# EasyEDA Pro project ProPrj_bbTalkie.epro

# Schematic Schematic1
Board Name: Board1; Create Date: 2025-03-17; Page Name: P1; Project Name: bbTalkie; Schematic Name: Schematic1; Update Date: 2025-06-26; BladeWidth: 10; Company: 嘉立创EDA; Page Size: A4; RegionStart: 1; ShowBorder: 1; TitleBlock: 0; TitleBlockPosition: 3; Version: V1.0; XRegionCount: 6; YRegionCount: 4
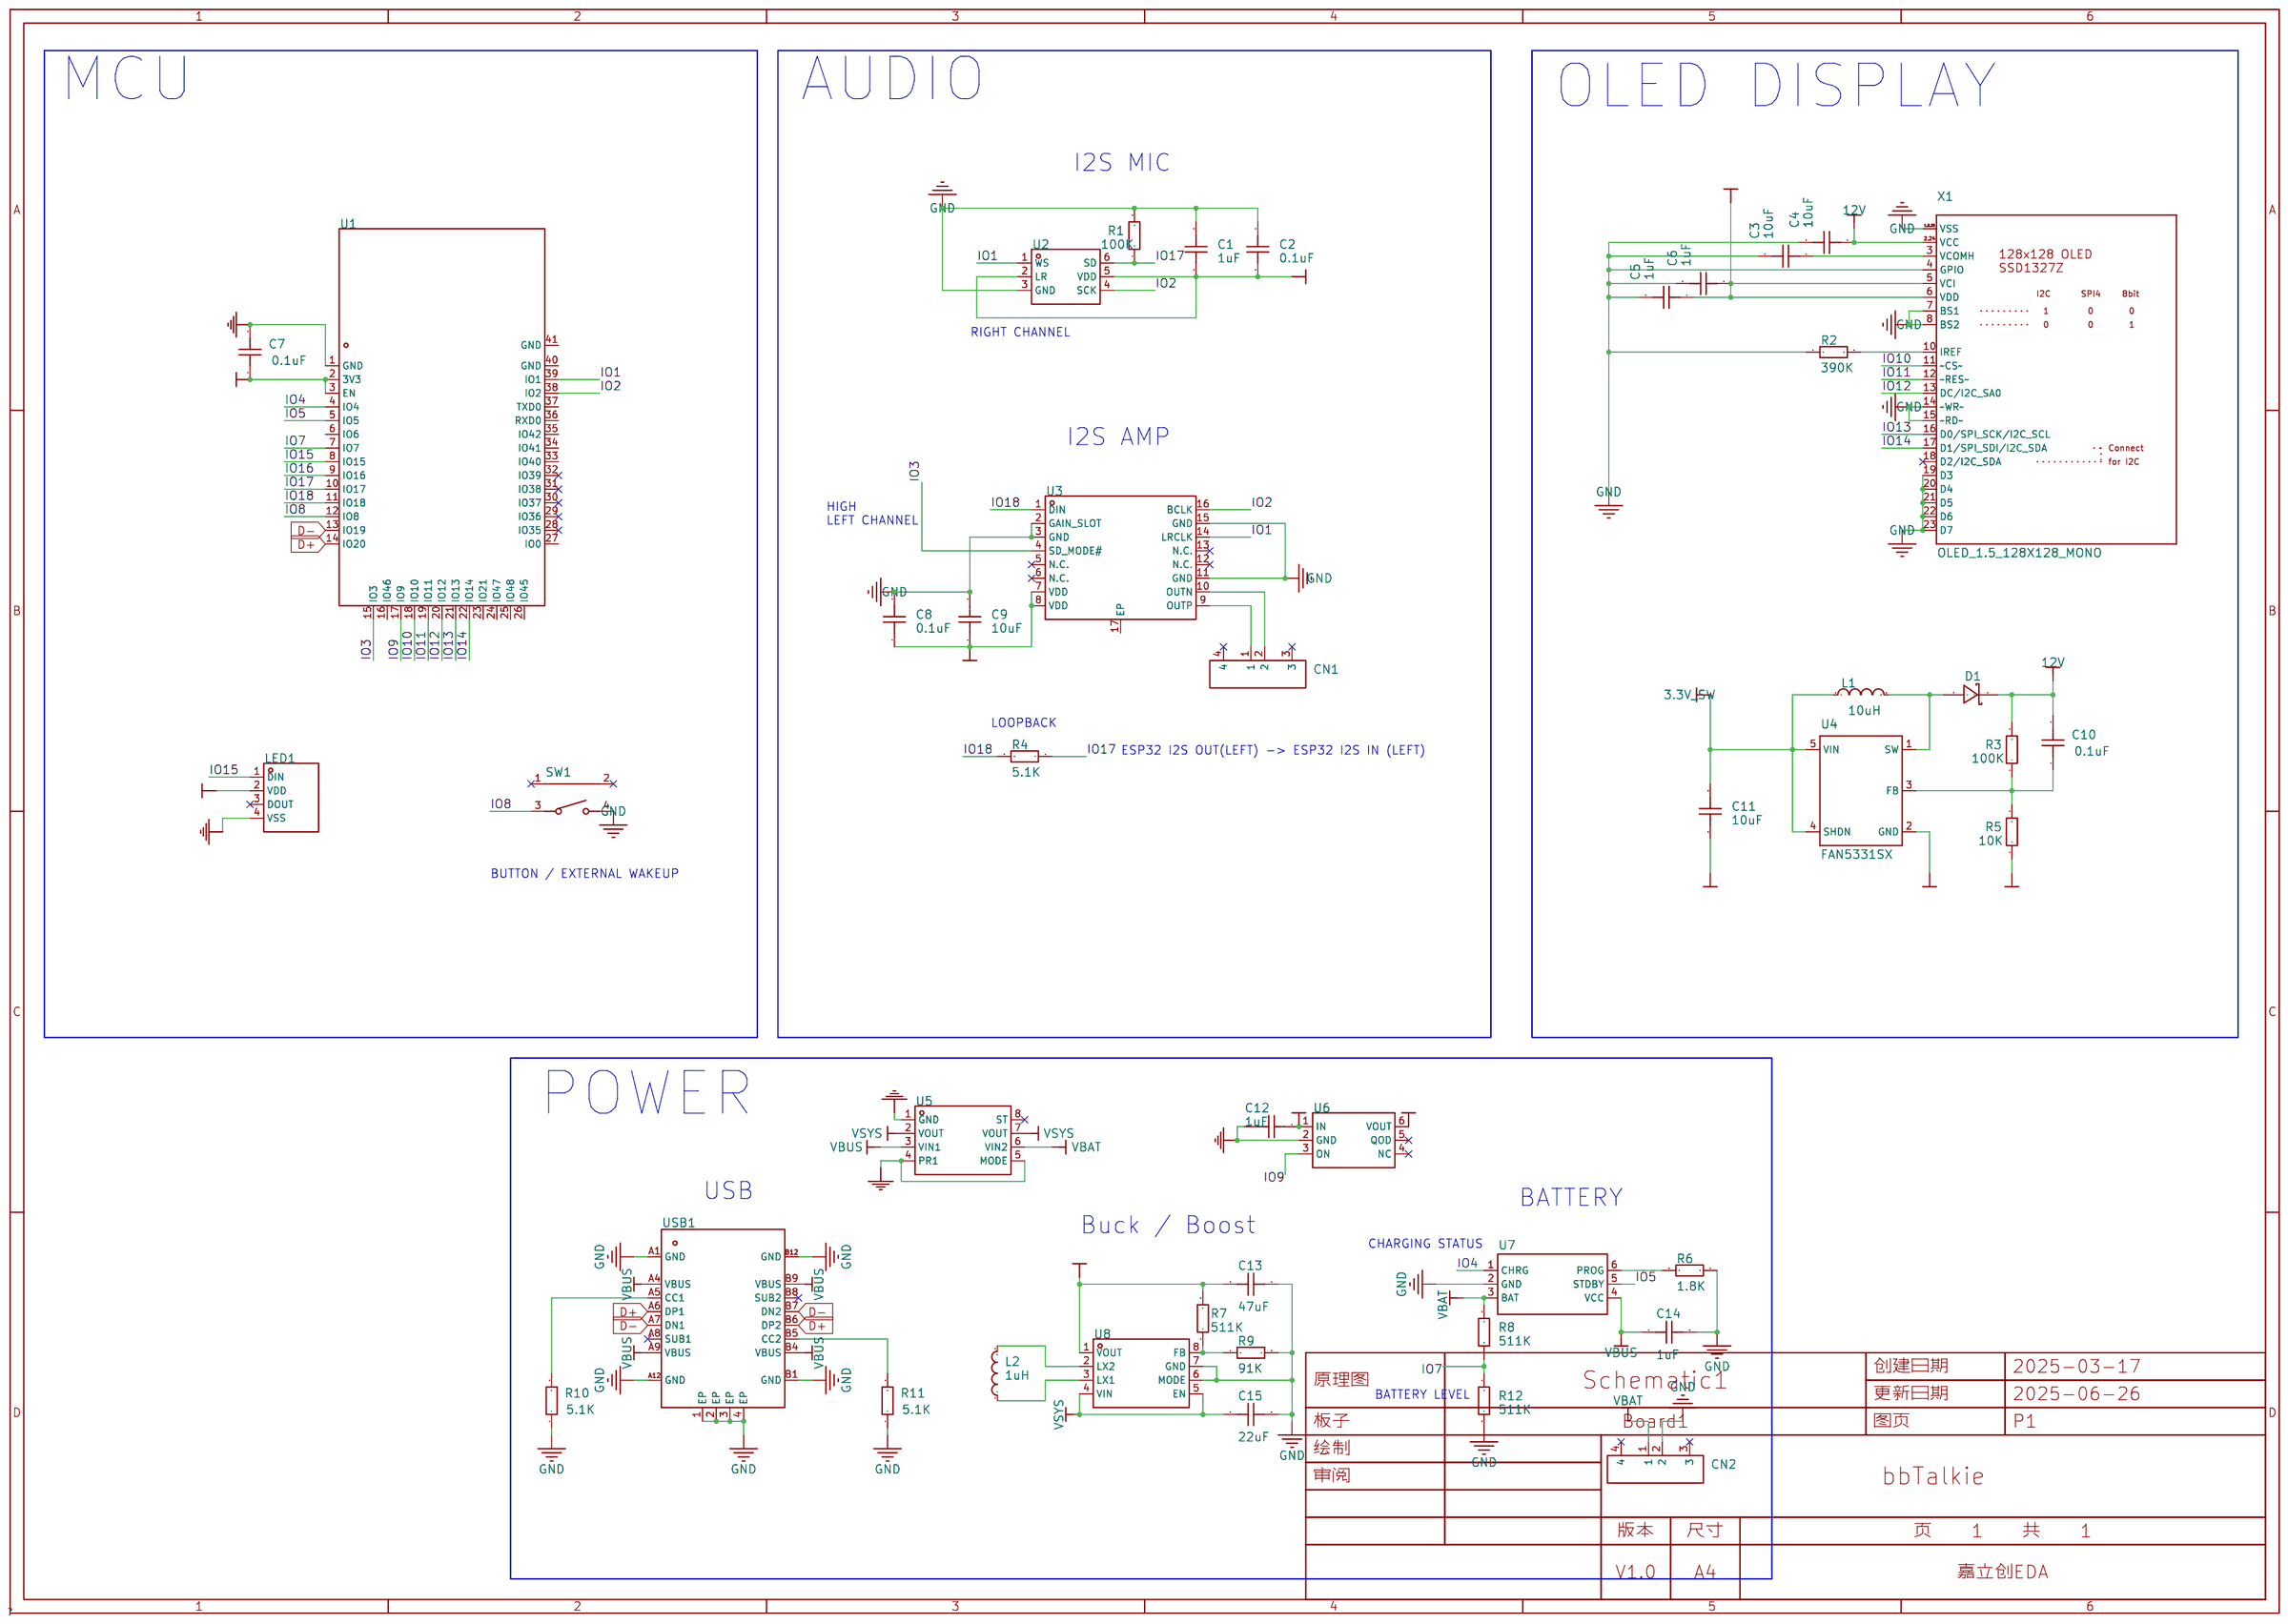
[diagram p0: schematic sheet]

## Parts
C1  1uF  [C0603]
C2  0.1uF  [C0603]
C3  10uF  [C0603]
C4  10uF  [C0603]
C5  1uF  [C0603]
C6  1uF  [C0603]
C7  0.1uF  [C0603]
C8  0.1uF  [C0603]
C9  10uF  [C0603]
C10  0.1uF  [C0603]
C11  10uF  [C0603]
C12  1uF  [C0603]
C13  47uF  [C0603]
C14  1uF  [C0603]
C15  22uF  [C0603]
CN1  SM02B-SRSS-TB(LF)(SN)  [CONN-SMD_2P-P1.00_SM02B-SRSS-TB-LF-SN]
CN2  SM02B-SRSS-TB(LF)(SN)  [CONN-SMD_2P-P1.00_SM02B-SRSS-TB-LF-SN]
D1  B5819WS  [SOD-323_L1.8-W1.3-LS2.5-RD]
L1  10uH  [IND-SMD_L2.5-W2.0_SWPA252012S]
L2  1uH  [IND-SMD_L2.0-W1.6-B]
LED1  WS2812B-4020  [LED-SMD_WS2812B-4020]
R1  100K  [R0603]
R2  390K  [R0603]
R3  100K  [R0603]
R4  5.1K  [R0603]
R5  10K  [R0603]
R6  1.8K  [R0603]
R7  511K  [R0603]
R8  511K  [R0603]
R9  91K  [R0603]
R10  5.1K  [R0603]
R11  5.1K  [R0603]
R12  511K  [R0603]
SW1  TS24CA  [SW-SMD_TS24CA]
U1  ESP32-S3-WROOM-1-N16R8  [WIRELM-SMD_ESP32-S3-WROOM-1]
U2  ICS-43434  [MIC-SMD_6P-L3.5-W2.7-P0.90-BL]
U3  MAX98357AETE+T  [TQFN-16_L3.0-W3.0-P0.50-BL-EP1.5]
U4  FAN5331SX  [SOT23-5@1]
U5  TPS2116DRLR  [SOT-583-8_L2.1-W1.6-P0.50-LS1.6-BL]
U6  TPS22919DCKR  [SC-70-6_L2.2-W1.3-P0.65-LS2.1-BR]
U7  ME4055AM6G-N  [SOT-23-6_L2.9-W1.6-P0.95-LS2.8-BR]
U8  TPS631000DRLR  [SOT-583-8_L2.1-W1.2-P0.50-LS1.6-BL]
USB1  -  [USB-C-SMD_KH-TYPE-C-16P]
X1  OLED_1.5_128X128_MONO  [OLED_1.5IN_128X128MONO]

## Library data of the parts
C1-C15 = CAP_0603: Supplier Footprint: 0603
CN1 CN2 = SM02B-SRSS-TB(LF)(SN): 插针结构:1x2P;间距:1mm;安装方式:卧贴;参考系列:SH;总PIN数:2P;排数:1;每排PIN数:2;行距:-;额定电流:1A;触头材质:铜合金;触头镀层:锡;工作温度范围:-25℃~+85℃;; LCSC Part Name: 1x2P 间距:1mm 卧贴 系列:SH; Supplier Part: C160402; Manufacturer: JST; Supplier Footprint: SMD,P=1mm,卧贴; JLCPCB Part Class: 扩展库; Datasheet: https://atta.szlcsc.com/upload/public/pdf/source/20181010/C265335_7D2AD766CA0E20E745663C87507A223E.pdf; Supplier: LCSC; Pins Structure: 1x2P; Pitch: 1mm; Mounting Style: 卧贴; Reference Series: SH; Number of Pins: 2P; Number of Rows: 1; Number of PINs Per Row: 2; Current Rating (Max): 1A; Contact Material: 铜合金; Contact Plating: 锡; Operating Temperature Range: -25℃~+85℃; Rated Voltage (Max): 50V; Plastic Material: PA; Flame Retardant Rating: UL94V-0; Supplementary Features: 辅助焊脚; Colour: 白色; Z-Height of the Board: 2.9mm; X-Length of Bottom Edge on Board (Spacing Line): 4mm; Y-Width of Bottom Edge on Board: 4.32mm
D1 = B5819WS_C22624: 正向压降(Vf):600mV@1A;直流反向耐压(Vr):40V;平均整流电流(Io):1A;; LCSC Part Name: 电压:40V 电流:1A; Supplier Part: C22624; Manufacturer: CJ(江苏长电/长晶); Supplier Footprint: SOD-323; JLCPCB Part Class: 扩展库; Datasheet: https://atta.szlcsc.com/upload/public/pdf/source/20150407/1457707273359.pdf; Supplier: LCSC; Forward Voltage (Vf@If): 600mV@1A; Reverse Voltage (Vr): 40V; Average Rectified Current (Io): 1A
L1 = SWPA252012S100MT: 电感值:10uH;精度:±20%;额定电流:620mA;饱和电流(Isat):880mA;类型:-;; LCSC Part Name: 10uH ±20% 880mA; Supplier Part: C37428; Manufacturer: Sunlord(顺络); Supplier Footprint: 1008; JLCPCB Part Class: 扩展库; Datasheet: https://atta.szlcsc.com/upload/public/pdf/source/20231024/317626D2AA2F8AB4113C1875E432E6E1.pdf; Supplier: LCSC; Tolerance: ±20%; Rated Current: 620mA; Current - Saturation(Isat): 880mA; DC Resistance(DCR): 690mΩ
L2 = FTC201610S1R0MBCA: 电感值:1uH;精度:±20%;额定电流:4.5A;饱和电流(Isat):4.6A;类型:一体成型电感;; LCSC Part Name: 1uH ±20% 4.6A; Supplier Part: C5832342; Manufacturer: cjiang(长江微电); Supplier Footprint: SMD,1.6x2mm; JLCPCB Part Class: 扩展库; Datasheet: https://atta.szlcsc.com/upload/public/pdf/source/20230602/8FFEDA9C0247A92A0D4B67554BFE4091.pdf; Supplier: LCSC; Tolerance: ±20%; Rated Current: 4.5A; Saturation Current (Isat): 4.6A; DC Resistance (DCR): 35mΩ; Type: 一体成型电感
LED1 = WS2812B-4020: 侧发光，无需外围元器件，适用于鼠标，键盘，机箱风扇，差异化产品（注意防潮，请查阅规格书中对应具体内容）; LCSC Part Name: RGB三色; Supplier Part: C965557; Manufacturer: worldsemi; Supplier Footprint: SMD,2x4mm; JLCPCB Part Class: 扩展库; Datasheet: https://atta.szlcsc.com/upload/public/pdf/source/20201203/C965557_D4D919E14814D6BA44043987D39B5520.pdf; Supplier: LCSC
R1-R12 = Res_0603: Supplier Footprint: 0603
SW1 = TS24CA: 电路结构:单刀单掷;按钮形状:矩形按钮;安装方式:卧贴;开关长度:4.55mm;开关宽度:1.8mm;开关高度:3.5mm;触点电流:50mA;额定电压(DC):12V;带灯:-;机械寿命:-;; LCSC Part Name: 4.55*1.8*3.5mm 卧贴 轻触开关; Supplier Part: C393942; Manufacturer: SHOU HAN(首韩); Supplier Footprint: SMD; JLCPCB Part Class: 扩展库; Datasheet: https://atta.szlcsc.com/upload/public/pdf/source/20190521/C393942_591A9E318887EFA4274D34029981AD99.pdf; Supplier: LCSC; Circuit: 单刀单掷; Actuator Style: 矩形按钮; Mounting Style: 卧贴; Switch Length: 4.55mm; Switch Width: 1.8mm; Switch Height: 3.5mm; Contact Current: 50mA; Voltage Rating (DC): 12V
U1 = ESP32-S3-WROOM-1-N16R8: LCSC Part Name: 通用型Wi-Fi+低功耗蓝牙MCU模组; Supplier Part: C2913202; Manufacturer: ESPRESSIF(乐鑫); Supplier Footprint: SMD,18x25.5mm; JLCPCB Part Class: 扩展库; Datasheet: https://atta.szlcsc.com/upload/public/pdf/source/20220705/4E799F39581577F766659887F738A439.pdf; Supplier: LCSC
U2 = ICS-43434_C5656610: 方向:全指向;信噪比:64dB;灵敏度:-;; Supplier Part: C5656610; Manufacturer: TDK InvenSense(应美盛); JLCPCB Part Class: 扩展库; Datasheet: https://atta.szlcsc.com/upload/public/pdf/source/231023/DS-000069-ICS-43434-v1.2-8194c7772d771e21a553109502704f97.pdf; Supplier: LCSC; Direction: 全指向; Supply Voltage: 1.65V~3.63V; Current Consumption: 550uA; SNR(Signal to Noise Ratio): 64dB
U3 = MAX98357AETE+T: 功放类型:-;扬声器通道数:单声道;输出功率:3.2Wx2@4Ω;; LCSC Part Name: 微型、低成本、PCM 类 D 级放大器具有 AB 级性能; Supplier Part: C910544; Manufacturer: ADI(亚德诺)/MAXIM(美信); Supplier Footprint: TQFN-16-EP(3x3); JLCPCB Part Class: 扩展库; Datasheet: https://atta.szlcsc.com/upload/public/pdf/source/20210106/C910544_CB6DE4B2CEE254A72E6BDB40E718D281.pdf; Supplier: LCSC; Speaker Channels: 单声道; Output Power: 3.2Wx2@4Ω; Supply Voltage: 2.5V~5.5V; Operating Temperature: -40℃~+85℃
U4 = microbuilder_FAN5331_
U5 = TPS2116DRLR: 通道数:2;输入控制逻辑:高电平有效;输出电流:2.5A;工作电压:1.6V~5.5V;导通电阻:42mΩ;; Supplier Part: C3235557; Manufacturer: TI(德州仪器); Supplier Footprint: SOT-583; JLCPCB Part Class: 扩展库; Datasheet: https://www.ti.com/cn/lit/gpn/tps2116; Supplier: LCSC; Number of Channels: 2; Control Input Logic: 高电平有效; Output Current: 2.5A; Voltage - Supply: 1.6V~5.5V; RDS(on): 42mΩ; Operating Temperature	-: -40℃~+105℃
U6 = TPS22919DCKR: 通道数:1;输出电流:1.5A;输入电压:1.6V~5.5V;导通电阻:89mΩ;; Supplier Part: C2149796; Manufacturer: TI(德州仪器); Supplier Footprint: SC-70-6; JLCPCB Part Class: 扩展库; Datasheet: https://www.ti.com/cn/lit/gpn/tps22919; Supplier: LCSC; Number of Outputs: 1; Output Current: 1.5A; Input Voltage: 1.6V~5.5V; Resistor On-State: 89mΩ; Operating Temperature	-: -40℃~+125℃
U7 = ME4055AM6G-N: 600mA锂离子电池充电，双灯; Supplier Part: C82121; Manufacturer: MICRONE(南京微盟); Supplier Footprint: SOT-23-6; JLCPCB Part Class: 扩展库; Datasheet: https://atta.szlcsc.com/upload/public/pdf/source/20220725/CF75E00328DA2B5A5E9B3EE80A9510AE.pdf; Supplier: LCSC
U8 = TPS631000DRLR: 输入电压:1.6V~5.5V;输出电压:1.2V~5.3V;输出电流(最大值):2A;; Supplier Part: C5219190; Manufacturer: TI(德州仪器); Supplier Footprint: SOT-583; JLCPCB Part Class: 扩展库; Datasheet: https://www.ti.com/cn/lit/gpn/tps631000; Supplier: LCSC; Input Voltage: 1.6V~5.5V; Output Voltage: 1.2V~5.3V; Output Current (Max): 2A; Switching Frequency: 2.2MHz; Operating Temperature: -40℃~+125℃; Topology: 降压-升压式; Quiescent Current (Iq): 8uA; Switch tube (built-in/external): 内置
USB1 = KH-TYPE-C-16P: 连接器类型:Type-C;标准:-;公母:母座;触点数量:16;端口数量:1;安装方式:卧贴;额定电流 - 电源:3A;工作温度范围:-40~+85;; LCSC Part Name: Type-C 母座 卧贴; Supplier Part: C709357; Manufacturer: kinghelm(金航标); Supplier Footprint: SMD; JLCPCB Part Class: Extended Part; Datasheet: https://atta.szlcsc.com/upload/public/pdf/source/20200911/C709357_AA8DCEB38BB20E3035A7ED7AE7667837.pdf; Supplier: LCSC; Connector Type: Type-C; Gender: 母座; Number of Contacts: 16; Number of Ports: 1; Mounting Style: 卧贴; Current Rating - Power (Max): 3A; Operating Temperature Range: -40~+85
X1 = adafruit_display_OLED_1.5_128X128_MONO_

## Nets
3.3V: C7.1 C12.2 C13.2 R7.2 U1.2(3V3) U1.3(EN) U6.1(IN) U8.1(VOUT)
3.3V_SW: C1.2 C2.2 C5.1 C6.1 C8.1 C9.1 C11.2 L1.1 LED1.2(VDD) U2.2(LR) U2.5(VDD) U3.7(VDD) U3.8(VDD) U4.4(SHDN) U4.5(VIN) U6.6(VOUT) X1.5(VCI) X1.6(VDD)
12V: C4.1 C10.2 D1.1(K) R3.2 X1.2,24(VCC)
GND: C1.1 C2.1 C3.2 C4.2 C5.2 C6.2 C7.2 C8.2 C9.2 C11.1 C12.1 C13.1 C14.2 C15.2 CN2.2 LED1.4(VSS) R1.2 R2.2 R5.1 R6.1 R9.1 R10.1 R11.1 R12.2 SW1.4 U1.1(GND) U2.3(GND) U3.2(GAIN_SLOT) U3.3(GND) U3.11(GND) U3.15(GND) U4.2(GND) U5.1(GND) U5.4(PR1) U5.5(MODE) U6.2(GND) U7.2(GND) U8.6(MODE) U8.7(GND) USB1.1(EP) USB1.2(EP) USB1.3(EP) USB1.4(EP) USB1.A1(GND) USB1.A12(GND) USB1.B1(GND) USB1.B12(GND) X1.1,9,25(VSS) X1.4(GPIO) X1.7(BS1) X1.8(BS2) X1.14(~WR~) X1.15(~RD~) X1.19(D3) X1.20(D4) X1.21(D5) X1.22(D6) X1.23(D7)
VBAT: CN2.1 R8.1 U5.6(VIN2) U7.3(BAT)
VBUS: C14.1 U5.3(VIN1) U7.4(VCC) USB1.A4(VBUS) USB1.A9(VBUS) USB1.B4(VBUS) USB1.B9(VBUS)
D+: U1.14(IO20) USB1.A6(DP1) USB1.B6(DP2)
D-: U1.13(IO19) USB1.A7(DN1) USB1.B7(DN2)
IO1: U1.39(IO1) U2.1(WS) U3.14(LRCLK)
IO2: U1.38(IO2) U2.4(SCK) U3.16(BCLK)
IO3: U1.15(IO3) U3.4(SD_MODE#)
IO4: U1.4(IO4) U7.1(CHRG)
IO5: U1.5(IO5) U7.5(STDBY)
IO7: R8.2 R12.1 U1.7(IO7)
IO8: SW1.3 U1.12(IO8)
IO9: U1.17(IO9) U6.3(ON)
IO10: U1.18(IO10) X1.11(~CS~)
IO11: U1.19(IO11) X1.12(~RES~)
IO12: U1.20(IO12) X1.13(DC/I2C_SA0)
IO13: U1.21(IO13) X1.16(D0/SPI_SCK/I2C_SCL)
IO14: U1.22(IO14) X1.17(D1/SPI_SDI/I2C_SDA)
IO15: LED1.1(DIN) U1.8(IO15)
IO16: U1.9(IO16)
IO17: R1.1 R4.1 U1.10(IO17) U2.6(SD)
IO18: R4.2 U1.11(IO18) U3.1(DIN)
VSYS: C15.1 U5.2(VOUT) U5.7(VOUT) U8.4(VIN) U8.5(EN)
$1N758: R11.2 USB1.B5(CC2)
$1N759: R10.2 USB1.A5(CC1)
$1N3146: D1.2(A) L1.2 U4.1(SW)
$1N3159: C10.1 R3.1 R5.2 U4.3(FB)
$1N3440: C3.1 X1.3(VCOMH)
$1N3636: R2.1 X1.10(IREF)
$1N11708: CN1.1 U3.9(OUTP)
$1N11713: CN1.2 U3.10(OUTN)
$1N21943: R6.2 U7.6(PROG)
$1N31976: L2.2 U8.2(LX2)
$1N31982: L2.1 U8.3(LX1)
$1N32158: R7.1 R9.2 U8.8(FB)

Not connected (* = marked no-connect by the designer): CN1 3* 4*; CN2 3* 4*; LED1 3(DOUT)*; SW1 1* 2*; U1 6(IO6) 16(IO46) 23(IO21) 24(IO47) 25(IO48) 26(IO45) 27(IO0) 28(IO35)* 29(IO36)* 30(IO37)* 31(IO38)* 32(IO39)* 33(IO40) 34(IO41) 35(IO42) 36(RXD0) 37(TXD0) 40(GND) 41(GND); U3 5(N.C.)* 6(N.C.)* 12(N.C.)* 13(N.C.)* 17(EP); U5 8(ST)*; U6 4(NC)* 5(QOD)*; USB1 A8(SUB1)* B8(SUB2)*; X1 18(D2/I2C_SDA)*

## Notes on the sheet
- MCU
- AUDIO
- OLED DISPLAY
- I2S MIC
- RIGHT CHANNEL
- I2S AMP
- HIGH
  LEFT CHANNEL
- LOOPBACK
- ESP32 I2S OUT(LEFT) -> ESP32 I2S IN (LEFT)
- BUTTON / EXTERNAL WAKEUP
- POWER
- USB
- BATTERY
- Buck / Boost
- CHARGING STATUS
- BATTERY LEVEL

# Board PCB1
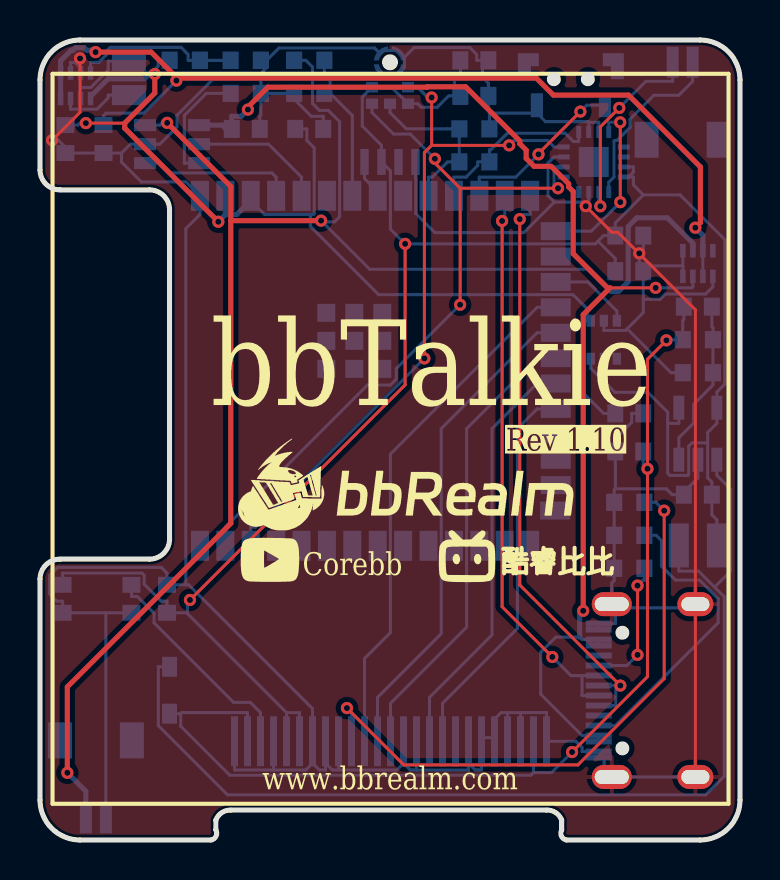
[diagram p1: board, top side]
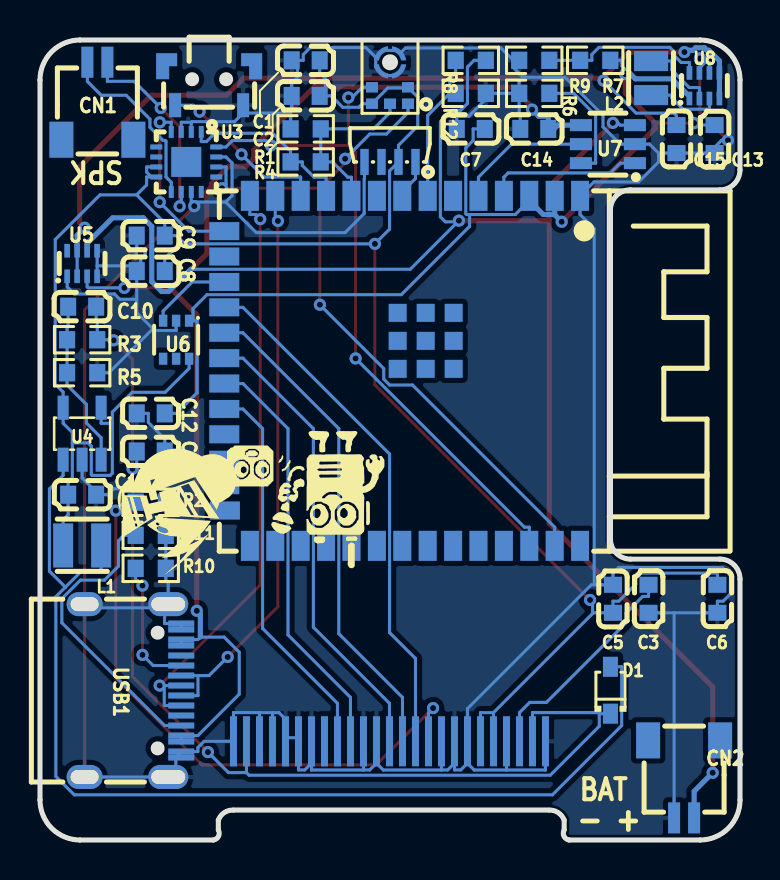
[diagram p2: board, bottom side, seen from below]

Outline 35 x 40 mm; copper layers: Top Layer, Bottom Layer. Coordinates in mm from the lower left corner of the outline.
Outline path: 0,38 0,33.51 arc(0.29,32.8) 1,32.51 5.48,32.51 arc(6.18,32.21) 6.48,31.51 6.48,15.04 arc(6.18,14.34) 5.48,14.04 1,14.04 arc(0.29,13.75) 0,13.04 0,2 arc(0.59,0.59) 2,0 8.55,0 arc(8.8,0.19) 8.79,0.5 8.79,1 arc(9.09,1.37) 9.55,1.5 25.33,1.5 arc(25.79,1.37) 26.08,1 26.08,0.5 arc(26.07,0.19) 26.33,0 33,0 arc(34.41,0.59) 35,2 35,38 arc(34.41,39.41) 33,40 2,40 arc(0.59,39.41) 0,38
Stack: Top Layer 0.035mm / Dielectric1 1.51mm FR4 er 4.5 / Bottom Layer 0.035mm

## Design rules (mm)
spacing copperThickness1oz (default): track to track 0.102, other pairs 0.102 to 0.3
spacing copperThickness2oz: track to track 0.203, other pairs 0.152 to 0.3
spacing Plane_innerPlane: track to track 0.102, other pairs 0.102 to 0.3
spacing Copper_copperRegion: track to track 0.102, other pairs 0.102 to 0.3
track width copperThickness1oz (default): min 0.127, default 0.152, max 2.54
track width copperThickness2oz: min 0.203, default 0.254, max 2.54
differential pair differentialPair (default): width min 0.127, default 0.254, max 2.54; gap min 0.152, default 0.152
pour e741 uses Copper_copperRegion
pour e757 uses Copper_copperRegion

## Placement (name value [footprint] x y rotation side)
C1  1uF  [C0603]  21.72 38.98 180 bottom
C2  0.1uF  [C0603]  21.72 37.21 180 bottom
C3  10uF  [C0603]  4.57 12.06 270 bottom
C4  10uF  [C0603]  29.46 19.43 180 bottom
C5  1uF  [C0603]  6.35 12.06 90 bottom
C6  1uF  [C0603]  1.13 12.06 270 bottom
C7  0.1uF  [C0603]  13.46 35.56 0 bottom
C8  0.1uF  [C0603]  29.46 28.44 0 bottom
C9  10uF  [C0603]  29.46 30.22 0 bottom
C10  0.1uF  [C0603]  32.89 26.67 180 bottom
C11  10uF  [C0603]  32.89 17.27 0 bottom
C12  1uF  [C0603]  29.46 21.33 180 bottom
C13  47uF  [C0603]  1.27 35.05 90 bottom
C14  1uF  [C0603]  10.29 35.56 0 bottom
C15  22uF  [C0603]  3.18 35.05 270 bottom
CN1  SM02B-SRSS-TB(LF)(SN)  [CONN-SMD_2P-P1.00_SM02B-SRSS-TB-LF-SN]  32.13 36.95 180 bottom
CN2  SM02B-SRSS-TB(LF)(SN)  [CONN-SMD_2P-P1.00_SM02B-SRSS-TB-LF-SN]  2.79 3.04 0 bottom
D1  B5819WS  [SOD-323_L1.8-W1.3-LS2.5-RD]  6.48 7.49 90 bottom
L1  10uH  [IND-SMD_L2.5-W2.0_SWPA252012S]  32.89 14.73 180 bottom
L2  1uH  [IND-SMD_L2.0-W1.6-B]  4.44 38.09 90 bottom
LED1  WS2812B-4020  [LED-SMD_WS2812B-4020]  17.5 33.9 180 bottom
R1  100K  [R0603]  21.72 35.56 0 bottom
R2  390K  [R0603]  29.46 16.89 180 bottom
R3  100K  [R0603]  32.89 25.01 180 bottom
R4  5.1K  [R0603]  21.72 33.9 0 bottom
R5  10K  [R0603]  32.89 23.36 0 bottom
R6  1.8K  [R0603]  10.29 37.33 180 bottom
R7  511K  [R0603]  7.24 38.98 180 bottom
R8  511K  [R0603]  13.46 38.98 0 bottom
R9  91K  [R0603]  10.29 38.98 180 bottom
R10  5.1K  [R0603]  29.46 13.58 0 bottom
R11  5.1K  [R0603]  29.46 15.23 0 bottom
R12  511K  [R0603]  13.46 37.33 180 bottom
SW1  TS24CA  [SW-SMD_TS24CA]  26.54 37.71 180 bottom
U1  ESP32-S3-WROOM-1-N16R8  [WIRELM-SMD_ESP32-S3-WROOM-1]  16.89 23.46 270 bottom
U2  ICS-43434  [MIC-SMD_6P-L3.5-W2.7-P0.90-BL]  17.5 38.1 90 bottom
U3  MAX98357AETE+T  [TQFN-16_L3.0-W3.0-P0.50-BL-EP1.5]  27.69 33.9 0 bottom
U4  FAN5331SX  [SOT23-5@1]  32.89 20.31 180 bottom
U5  TPS2116DRLR  [SOT-583-8_L2.1-W1.6-P0.50-LS1.6-BL]  32.89 28.82 180 bottom
U6  TPS22919DCKR  [SC-70-6_L2.2-W1.3-P0.65-LS2.1-BR]  28.19 25.01 90 bottom
U7  ME4055AM6G-N  [SOT-23-6_L2.9-W1.6-P0.95-LS2.8-BR]  6.6 34.79 180 bottom
U8  TPS631000DRLR  [SOT-583-8_L2.1-W1.2-P0.50-LS1.6-BL]  1.78 37.71 180 bottom
USB1  -  [USB-C-SMD_KH-TYPE-C-16P]  30.35 7.47 270 bottom
X1  OLED_1.5_128X128_MONO  [OLED_1.5IN_128X128MONO]  17.53 20.06 0 top

## Footprints (pads in the part's own frame, mm; a bottom-side part is the same pattern mirrored in y, then rotated)
C0603
  rect 0.8x0.9 smd: 1(-0.7,0) 2(0.7,0)
CONN-SMD_2P-P1.00_SM02B-SRSS-TB-LF-SN
  rect 0.6x1.55 smd: 1(-0.5,1.938) 2(0.5,1.938)
  rect 1.2x1.8 smd: 3(1.8,-1.938) 4(-1.8,-1.938)
IND-SMD_L2.0-W1.6-B
  rect 1x1.7 smd: 1(-0.85,0) 2(0.85,0)
IND-SMD_L2.5-W2.0_SWPA252012S
  rect 1x2.2 smd: 1(-0.951,0) 2(0.951,0)
LED-SMD_WS2812B-4020
  rect 0.42x1.3 smd: 1(1.275,0) 2(0.425,0) 3(-0.425,0) 4(-1.275,0)
MIC-SMD_6P-L3.5-W2.7-P0.90-BL
  rect 0.52x0.6 smd: 1(-1.286,-0.9) 2(-0.465,-0.9) 4(-0.465,0.9) 5(-1.286,0.9) 6(-1.286,0)
  custom 0.709x0.71 smd: 3(0.276,-0.452) 3(0.329,0.505) 3(1.234,-0.505) 3(1.286,0.452)
OLED_1.5IN_128X128MONO
  rect 0.35x2.5 smd far side: 1(-7.8,-15.125) 2(-7.15,-15.125) 3(-6.5,-15.125) 4(-5.85,-15.125) 5(-5.2,-15.125) 6(-4.55,-15.125) 7(-3.9,-15.125) 8(-3.25,-15.125) 9(-2.6,-15.125) 10(-1.95,-15.125) 11(-1.3,-15.125) 12(-0.65,-15.125) 13(0,-15.125) 14(0.65,-15.125) 15(1.3,-15.125) 16(1.95,-15.125) 17(2.6,-15.125) 18(3.25,-15.125) 19(3.9,-15.125) 20(4.55,-15.125) 21(5.2,-15.125) 22(5.85,-15.125) 23(6.5,-15.125) 24(7.15,-15.125) 25(7.8,-15.125)
R0603
  rect 0.806x0.864 smd: 1(-0.753,0) 2(0.753,0)
SC-70-6_L2.2-W1.3-P0.65-LS2.1-BR
  rect 0.6x0.42 smd: 1(0.95,-0.65) 2(0.95,0) 3(0.95,0.65) 4(-0.95,0.65) 5(-0.95,0) 6(-0.95,-0.65)
SOD-323_L1.8-W1.3-LS2.5-RD
  rect 1x0.75 smd: 1(-1.173,0) 2(1.173,0)
SOT23-5@1
  rect 0.55x1.2 smd: 1(-0.95,-1.3) 2(0,-1.3) 3(0.95,-1.3) 4(0.95,1.3) 5(-0.95,1.3)
SOT-23-6_L2.9-W1.6-P0.95-LS2.8-BR
  rect 1.1x0.6 smd: 1(1.35,-0.95) 2(1.35,0) 3(1.35,0.95) 4(-1.35,0.95) 5(-1.35,0) 6(-1.35,-0.95)
SOT-583-8_L2.1-W1.2-P0.50-LS1.6-BL
  rect 0.28x0.68 smd: 1(-0.75,-0.64) 2(-0.25,-0.64) 3(0.25,-0.64) 4(0.75,-0.64) 5(0.75,0.64) 6(0.25,0.64) 7(-0.25,0.64) 8(-0.75,0.64)
SOT-583-8_L2.1-W1.6-P0.50-LS1.6-BL
  rect 0.28x0.68 smd: 1(-0.75,-0.64) 2(-0.25,-0.64) 3(0.25,-0.64) 4(0.75,-0.64) 5(0.75,0.64) 6(0.25,0.64) 7(-0.25,0.64) 8(-0.75,0.64)
SW-SMD_TS24CA
  custom 1.05x1.3 smd: 1(-2.125,0.975) 2(2.125,0.975)
  rect 0.6x1.2 smd: 3(-1.7,-0.975) 4(1.7,-0.975)
TQFN-16_L3.0-W3.0-P0.50-BL-EP1.5
  rect 0.25x0.6 smd: 1(-0.749,-1.5) 2(-0.248,-1.5) 3(0.252,-1.5) 4(0.751,-1.5) 9(0.75,1.5) 10(0.25,1.5) 11(-0.25,1.5) 12(-0.749,1.5)
  rect 0.6x0.25 smd: 5(1.5,-0.748) 6(1.5,-0.248) 7(1.5,0.252) 8(1.5,0.752) 13(-1.5,0.752) 14(-1.5,0.252) 15(-1.5,-0.248) 16(-1.5,-0.748)
  rect 1.5x1.5 smd: 17(0,0)
USB-C-SMD_KH-TYPE-C-16P
  oval 1.2x2 hole 0.7x1.7: 1(-4.32,1.765) 2(4.32,1.765)
  oval 1.2x1.8 hole 0.7x1.4: 3(-4.32,-2.415) 4(4.32,-2.415)
  rect 0.3x1.3 smd: A1(-3.35,2.415) A4(-2.55,2.415) A5(-1.25,2.415) A6(-0.25,2.415) A7(0.25,2.415) A8(1.25,2.415) A9(2.55,2.415) A12(3.35,2.415) B1(3.05,2.415) B4(2.25,2.415) B5(1.75,2.415) B6(0.75,2.415) B7(-0.75,2.415) B8(-1.75,2.415) B9(-2.25,2.415) B12(-3.05,2.415)
WIRELM-SMD_ESP32-S3-WROOM-1
  rect 1.5x0.9 smd: 1(-8.75,8.895) 2(-8.75,7.625) 3(-8.75,6.355) 4(-8.75,5.085) 5(-8.75,3.815) 6(-8.75,2.545) 7(-8.75,1.275) 8(-8.75,0.005) 9(-8.75,-1.265) 10(-8.75,-2.535) 11(-8.75,-3.805) 12(-8.75,-5.075) 13(-8.75,-6.345) 14(-8.75,-7.615) 27(8.75,-7.615) 28(8.75,-6.345) 29(8.75,-5.075) 30(8.75,-3.805) 31(8.75,-2.535) 32(8.75,-1.265) 33(8.75,0.005) 34(8.75,1.275) 35(8.75,2.545) 36(8.75,3.815) 37(8.75,5.085) 38(8.75,6.355) 39(8.75,7.625) 40(8.75,8.895)
  rect 0.9x1.5 smd: 15(-6.985,-8.895) 16(-5.715,-8.895) 17(-4.445,-8.895) 18(-3.175,-8.895) 19(-1.905,-8.895) 20(-0.635,-8.895) 21(0.635,-8.895) 22(1.905,-8.895) 23(3.175,-8.895) 24(4.445,-8.895) 25(5.715,-8.895) 26(6.985,-8.865)
  rect 0.9x0.9 smd: 41(-2.9,-0.225) 41(-2.9,1.175) 41(-2.9,2.575) 41(-1.5,-0.225) 41(-1.5,1.175) 41(-1.5,2.575) 41(-0.1,-0.225) 41(-0.1,1.175) 41(-0.1,2.575)

## Nets
As in the schematic, except:
12V: C4.1 C10.2 D1.1 R3.2 X1.2 X1.24
GND: C1.1 C2.1 C3.2 C4.2 C5.2 C6.2 C7.2 C8.2 C9.2 C11.1 C12.1 C13.1 C14.2 C15.2 CN2.2 LED1.4 R1.2 R2.2 R5.1 R6.1 R9.1 R10.1 R11.1 R12.2 SW1.4 U1.1 U2.3 U3.2 U3.3 U3.11 U3.15 U4.2 U5.1 U5.4 U5.5 U6.2 U7.2 U8.6 U8.7 USB1.1 USB1.2 USB1.3 USB1.4 USB1.A1 USB1.A12 USB1.B1 USB1.B12 X1.1 X1.4 X1.7 X1.8 X1.9 X1.14 X1.15 X1.19 X1.20 X1.21 X1.22 X1.23 X1.25

Pads without a net: CN1 3 4; CN2 3 4; LED1 3; SW1 1 2; U1 6 16 23 24 25 26 27 28 29 30 31 32 33 34 35 36 37 40 41; U3 5 6 12 13 17; U5 8; U6 4 5; USB1 A8 B8; X1 18

## Via types
v1: diameter 0.61, hole 0.305, Top Layer to Bottom Layer, 41 vias

## Routing (per net, layer and track width the routed paths; a pad name or vN(x,y) marks a point on that pad's centre or on a via; arc(x,y) is an arc through that point)
3.3V: length 52.6
  Top Layer w0.152: v1(2.29,35.84) 4.24,35.84
  Top Layer w0.254: v1(5.74,38.3) 5.74,37.35 4.24,35.84 4.24,35.59 v1(8.92,30.91)
  Bottom Layer w0.152: 27.35,25.96 27.35,26.57 26.65,27.27 16.93,27.27 13.52,30.68 13.52,31.27 ; 27.35,25.96 U6.1 ; 27.35,25.96 27.15,25.96 27.15,25.96 27.15,22.36 28.18,21.33 C12.2 ; 13.52,31.27 13.66,31.27 13.71,31.32 13.71,34.61 13.34,34.97 13.34,35.56 12.76,35.56 ; 13.52,31.27 11.24,31.27 10.54,31.97 U1.3 ; v1(5.74,38.3) 5.62,38.42 5.9,38.69 5.9,38.98 6.48,38.98 ; v1(2.29,35.84) 2,35.84 1.9,35.75 C13.2
  Bottom Layer w0.254: 9.27,31.28 9.27,31.26 v1(8.92,30.91) ; 9.27,31.28 9.84,31.28 10.54,31.97 ; 9.27,31.28 U1.2 ; U8.1 2.53,37.18 3.4,38.06 5.23,38.06 5.59,38.42 5.62,38.42
3.3V_SW: length 109.5
  Top Layer w0.152: v1(7.5,12) 18.25,22.76 v1(18.25,29.81)
  Bottom Layer w0.152: 29.43,33.15 29.67,33.39 29.67,33.65 29.19,33.65 ; 29.43,33.15 29.67,33.15 29.67,32.75 30.17,32.26 ; 29.43,33.15 29.19,33.15 ; 31.38,20.83 31.38,21.39 30.39,22.38 28.74,22.38 27.54,23.58 U6.6 ; 31.38,20.83 31.94,20.83 U4.4 ; 31.38,20.83 31.38,18.34 31.49,18.23 32.39,18.23 32.43,18.28 32.43,19.69 32.6,19.86 33.38,19.86 ; U2.2 16.6,37.6 ; 16.6,37.6 16.57,37.6 16.11,37.15 16.11,35.7 17.07,34.74 17.07,33.9 17.52,33.46 17.52,30.54 v1(18.25,29.81) 27.77,29.81 27.9,29.94 ; 16.6,37.6 17.61,37.6 18.4,36.81 18.88,36.81 19.06,36.63 19.86,36.63 20.43,37.21 20.73,37.21 ; 27.9,29.94 28.18,30.22 C9.1 28.76,30.85 30.17,32.26 ; 27.9,29.94 28.76,29.08 C8.1 ; C6.1 1.13,13.34 1.13,13.34 5.1,13.34 5.21,13.24 5.21,12.79 6.06,11.94 6.35,11.94 C5.1 7.37,11.36 ; 12.33,6.37 12.98,6.37 X1.6 ; 12.33,6.37 7.37,11.32 7.37,11.36 ; 12.33,6.37 X1.5 ; 30.17,32.26 32,32.26 34.24,30.02 34.24,22.79 33.84,22.4 U4.5 33.84,20.83 33.38,20.38 33.38,19.86 ; 7.37,11.36 7.37,11.87 v1(7.5,12) ; 33.38,19.86 33.38,18.11 33.59,17.9 33.59,16.26 33.84,16.01 L1.1 ; 21.02,37.21 20.73,37.21 ; 20.73,37.21 20.73,38.06 21.02,38.35 21.02,38.98
12V: length 54.6
  Top Layer w0.152: v1(31.32,24.98) 30.37,24.04 v1(30.37,18.56) 30.37,8.17 v1(26.6,4.4)
  Bottom Layer w0.152: C4.1 30.16,18.77 v1(30.37,18.56) ; 24.68,3.37 25.58,3.37 v1(26.6,4.4) ; 24.68,3.37 X1.24 ; 24.68,3.37 24.54,3.24 9.49,3.24 7.04,5.69 7.04,6.31 ; 7.04,6.31 7.09,6.37 10.37,6.37 10.38,6.37 X1.2 ; 7.04,6.31 6.48,6.31 ; v1(31.32,24.98) 31.52,24.98 31.55,25.01 32.14,25.01 32.14,25.98 32.19,26.03 C10.2
GND: length 242.2
  Top Layer w0.152: 29.96,29.33 28.9,30.39 28.59,30.39 v1(27.29,31.69) ; 29.96,29.33 v1(29.96,29.33) ; 29.96,29.33 32.77,26.51 USB1.3 USB1.4 ; v1(0.6,34.99) 2,36.39 v1(2,39.08)
  Bottom Layer w0.152: 1.56,34.35 0.92,34.99 v1(0.6,34.99) ; 1.56,34.35 1.27,34.35 ; 1.56,34.35 4.07,34.35 ; 23.38,6.37 23.05,6.37 22.73,6.04 22.73,5.12 ; 23.38,6.37 X1.22 ; 23.38,6.37 24.03,6.37 ; 14.93,4.94 14.93,3.5 ; 14.93,3.5 14.93,3.5 17.84,3.5 18.18,3.84 ; 14.93,3.5 14.61,3.5 14.28,3.84 ; 11.33,38.98 11.95,39.6 16.73,39.6 U2.3 17.14,39.48 17.86,39.48 17.95,39.39 18.21,39.13 ; 11.33,38.98 11.04,38.98 ; 11.33,38.98 11.33,38.63 10.85,38.14 ; 28.77,17.56 31.32,17.56 31.61,17.27 32.06,17.27 ; 28.77,17.56 28.77,18.79 28.76,18.79 C4.2 28.76,20.06 29.58,20.88 29.58,21.33 C12.1 ; 28.77,17.56 28.71,17.5 R2.2 R11.1 R10.1 28.71,12.97 28.59,12.85 USB1.1 28.77,11.61 ; 10.85,38.14 11.04,37.95 11.04,37.33 ; 10.85,38.14 8.75,38.14 6.85,36.24 6.85,35.65 5.99,34.79 4.52,34.79 4.07,34.35 ; 11.04,37.33 11.04,36.24 10.99,36.19 C14.2 ; 11.04,37.33 12.42,37.33 ; 24.84,36.74 24.84,36.35 ; 24.84,36.35 22.47,36.35 ; 24.84,36.35 25.27,35.92 27.41,35.92 27.44,35.89 ; 27.44,35.89 27.94,35.89 U3.3 ; 27.44,35.89 27.44,35.41 ; 32.14,28.71 U5.5 ; 32.14,28.71 30.16,28.71 ; 32.14,28.71 U5.4 ; U2.3 17.2,38.23 17.8,38.23 18.21,38.64 18.21,39.13 ; 13.63,3.84 13.96,3.5 14.28,3.5 14.28,3.84 ; 13.63,3.84 13.29,3.5 11.68,3.5 11.68,3.5 ; 13.63,3.84 13.63,6.57 7.43,12.76 7.29,12.76 ; 33.64,28.18 33.64,27.66 33.28,27.3 31.27,27.3 31.01,27.04 30.16,27.04 ; 24.03,6.37 24.03,6.37 25.32,6.37 25.33,6.37 X1.25 26.79,4.94 27.1,4.62 27.1,4.42 USB1.B1 27.94,4.39 28.21,4.12 ; 24.03,6.37 X1.23 ; 21.43,4.94 21.43,3.84 ; 21.43,3.84 21.76,3.5 22.07,3.5 X1.20 22.07,5.12 22.73,5.12 ; 21.43,3.84 21.43,3.5 21.42,3.5 18.83,3.5 18.83,3.5 ; USB1.A12 28.21,4.12 ; 28.21,4.12 28.21,3.53 USB1.2 USB1.4 ; 18.21,39.13 18.7,39.62 21.49,39.62 21.84,39.27 21.84,38.98 22.13,38.98 ; 22.42,38.98 22.13,38.98 ; 22.13,38.98 22.13,38.13 22.42,37.84 22.42,36.57 22.47,36.52 22.47,36.35 ; 25.72,31.9 25.4,32.22 25.4,33.85 25.7,34.15 26.19,34.15 ; 25.72,31.9 24.19,30.37 19.75,30.37 18.79,31.32 18.79,33.06 18.78,33.07 LED1.4 ; 25.72,31.9 27.29,31.9 ; X1.1 9.73,3.5 9.73,3.5 11.67,3.5 11.68,3.5 ; C3.2 3.29,11.36 ; 3.29,11.36 3.29,1.1 ; 3.29,11.36 C6.2 1.13,11.94 0.84,11.94 0.48,12.3 0.48,13.23 0.88,13.63 6.06,13.63 6.35,13.34 C5.2 7.29,12.76 ; 1.75,38.88 2.03,38.6 U8.7 ; 1.75,38.88 1.95,39.08 v1(2,39.08) ; 1.75,38.88 1.53,38.88 U8.6 ; 7.29,12.76 7.29,30.57 8,31.28 U1.1 7.3,32.9 5.07,32.9 4.07,33.9 4.07,34.35 ; C11.1 32.06,17.27 ; 32.06,17.27 32.89,18.1 32.89,19.01 ; X1.21 22.73,5.12 ; R12.2 12.42,37.33 ; 12.42,37.33 13.56,36.19 14.16,36.19 14.16,35.56 ; 18.18,3.84 18.51,3.5 18.83,3.5 ; 18.18,3.84 X1.14 ; C9.2 30.16,29.54 v1(29.96,29.33) 29.96,28.91 30.16,28.71 ; 22.47,36.35 22.47,35.56 ; 29.35,25.56 31.55,23.36 32.14,23.36 ; 29.35,25.56 29.27,25.48 28.2,25.48 28.19,25.48 U6.2 ; 29.35,25.56 30.16,26.37 30.16,27.04 ; X1.4 11.68,3.5 ; 27.94,10.52 27.94,10.82 28.77,10.82 28.77,11.61 ; 18.83,3.5 X1.15 ; 28.77,11.61 32.59,11.61 USB1.3 ; 27.29,31.9 v1(27.29,31.69) ; 27.29,31.9 27.41,31.9 27.44,31.92 U3.11 ; 30.16,28.71 C8.2 30.16,27.04 ; 14.28,3.84 X1.8
VBAT: length 79.9
  Top Layer w0.254: v1(1.37,3.36) 1.37,7.66 9.54,15.83 9.54,30.97 ; 9.54,30.97 v1(14.05,30.97) ; 9.54,30.97 9.54,32.68 v1(6.36,35.86)
  Bottom Layer w0.152: 14.11,30.91 14.73,30.91 14.98,31.16 14.98,35.92 14.42,36.48 13.97,36.48 13.63,36.83 13.63,38.65 13.29,38.98 R8.1 ; 14.11,30.91 v1(14.05,30.97) ; 14.11,30.91 16.48,28.54 27.46,28.54 ; 5.26,35.74 5.99,35.74 6.1,35.86 v1(6.36,35.86)
  Bottom Layer w0.254: U5.6 32.64,29.83 31.37,31.11 29.84,31.11 29.41,30.68 29.41,27.92 28.92,27.43 28.57,27.43 27.46,28.54 ; v1(1.37,3.36) 2.29,2.43 2.29,1.1
VBUS: length 60.8
  Top Layer w0.152: v1(30.78,27.61) 28.5,27.61
  Top Layer w0.254: v1(10.4,36.52) 10.4,36.65 11.39,37.64 19.34,37.64 19.36,37.66 21.29,37.66 23.99,34.95 23.99,34.81 24.31,34.5 24.31,34.08 24.7,33.68 25.56,33.68 26.43,32.81 26.43,32.65 26.66,32.43 26.66,29.32 28.37,27.61 28.5,27.61 27.16,26.27 v1(27.16,11.46)
  Bottom Layer w0.152: USB1.A9 USB1.B4 27.1,5.22 25.04,7.29 25.04,9.39 25.79,10.14 26.98,10.14 27.1,10.02 27.94,10.02 27.94,9.72 ; U5.3 32.64,27.66 32.59,27.61 v1(30.78,27.61)
  Bottom Layer w0.254: 26.98,10.14 26.98,11.28 v1(27.16,11.46) ; v1(10.4,36.52) 10.06,36.19 9.59,36.19 9.59,35.56 9.3,35.56 9.11,35.74 7.96,35.74
D+: length 29.9
  Top Layer w0.152: v1(29.02,7.72) 23.99,12.75 v1(23.99,31.04)
  Bottom Layer w0.152: 28.77,7.72 v1(29.02,7.72) ; 28.77,7.72 28.79,7.7 28.79,6.74 28.77,6.72 27.94,6.72 ; 28.77,7.72 USB1.A6 ; U1.14 24.51,31.28 24.22,31.28 v1(23.99,31.04)
D-: length 28.7
  Top Layer w0.152: v1(25.62,9.15) 23.1,11.66 v1(23.1,30.95)
  Bottom Layer w0.152: U1.13 23.24,31.08 v1(23.1,30.95) ; 27.94,7.22 27.1,7.22 27.1,7.22 27.1,8.22 ; 27.1,8.22 26.55,8.22 v1(25.62,9.15) ; 27.1,8.22 27.11,8.22 USB1.B7
IO1: length 36.5
  Top Layer w0.152: v1(19.74,34.06) 19.74,33.85 21.01,32.59 ; 21.01,32.59 v1(21.01,26.76) ; 21.01,32.59 v1(25.9,32.59)
  Bottom Layer w0.152: U1.39 9.27,15.64 16.37,22.75 17.52,22.75 17.81,23.04 17.81,23.57 v1(21.01,26.76) ; 26.19,33.65 25.7,33.65 25.7,33.65 25.7,32.79 v1(25.9,32.59) ; v1(19.74,34.06) 18.51,35.3 17.68,35.3 16.6,36.37 16.6,36.81
IO2: length 34.5
  Top Layer w0.152: 19.58,34.73 19.22,34.37 v1(19.22,24.08) ; 19.58,34.73 v1(19.58,37.12) ; 19.58,34.73 v1(23.46,34.73)
  Bottom Layer w0.152: v1(23.46,34.73) 23.7,34.97 25.38,34.97 25.7,34.65 26.19,34.65 ; U2.4 18.88,37.64 19.39,37.12 v1(19.58,37.12) ; v1(19.22,24.08) 10.78,15.64 10.54,15.64 U1.38
IO3: length 8.9
  Top Layer w0.152: v1(29.01,31.89) 29.01,35.88 v1(29.01,35.89)
  Bottom Layer w0.152: U3.4 28.44,35.89 29.01,35.89 ; 25.79,30.44 27.56,30.44 v1(29.01,31.89)
IO4: length 7.8
  Bottom Layer w0.152: U1.4 11.81,33.14 11.59,33.35 6.48,33.35 5.99,33.84 5.26,33.84
IO5: length 6.7
  Bottom Layer w0.152: U1.5 13.08,33.14 11.42,34.79 7.96,34.79
IO7: length 7.6
  Bottom Layer w0.152: 14.51,37.33 14.51,38.08 14.22,38.37 R8.2 ; 14.51,37.33 15.62,36.23 U1.7 ; 14.51,37.33 R12.1
IO8: length 8.7
  Top Layer w0.152: v1(27.02,36.42) 24.93,34.32 v1(24.93,34.28)
  Bottom Layer w0.152: 28.24,36.74 27.34,36.74 v1(27.02,36.42) ; U1.12 21.97,33.14 21.97,33.14 23.79,33.14 v1(24.93,34.28)
IO9: length 4.1
  Bottom Layer w0.152: U6.3 28.84,26.45 27.39,27.9 U1.17
IO10: length 26.2
  Bottom Layer w0.152: X1.11 16.23,9.08 17.52,10.37 17.52,19.3 24.85,26.63 U1.18
IO11: length 24.7
  Bottom Layer w0.152: 25.79,25.36 24.85,25.36 20.06,20.57 20.06,10.32 16.88,7.13 X1.12
IO12: length 23.1
  Bottom Layer w0.152: U1.20 24.85,24.09 21.33,20.57 21.33,10.64 17.53,6.83 X1.13
IO13: length 21
  Bottom Layer w0.152: 25.79,22.82 24.85,22.82 22.6,20.57 22.6,10.26 19.48,7.13 X1.16
IO14: length 19.5
  Bottom Layer w0.152: 20.13,4.94 20.13,6.83 23.87,10.58 23.87,20.57 24.85,21.55 U1.22
IO15: length 2
  Bottom Layer w0.152: U1.8 16.89,32.41 16.23,33.07 16.23,33.9
IO17: length 8.7
  Bottom Layer w0.152: U1.10 19.43,33.14 19.61,33.14 20.38,33.9 20.96,33.9 20.96,35.56 20.38,35.56 20.37,35.56 18.32,35.56 17.5,36.37 17.5,36.81
IO18: length 9.2
  Bottom Layer w0.152: 26.94,35.41 26.94,34.92 26.68,34.92 26.26,35.34 23.37,35.34 22.55,34.52 22.47,34.52 22.47,33.9 21.88,33.9 21.88,33.72 21.3,33.14 20.7,33.14 U1.11
VSYS: length 47.4
  Top Layer w0.254: v1(32.77,30.61) 33.02,30.87 33.02,33.65 29.43,37.25 25.67,37.25 24.82,38.1 6.95,38.1 v1(6.82,37.97) 6.82,38.13 5.56,39.39 v1(2.78,39.39)
  Bottom Layer w0.152: C15.1 3.18,36.21 3.31,36.34 5.19,36.34 v1(6.82,37.97) ; 33.14,29.46 33.14,28.18
  Bottom Layer w0.254: v1(32.77,30.61) 33.14,30.24 33.14,29.46 ; U8.4 U8.5 1.03,38.96 1.56,39.49 1.65,39.49 1.78,39.61 2.22,39.61 2.35,39.49 2.56,39.49 2.65,39.39 v1(2.78,39.39)
$1N758: length 15
  Bottom Layer w0.152: R11.2 30.81,15.23 31.08,14.96 31.08,13.69 31.77,12.99 32.98,12.99 33.91,12.06 33.91,10.86 28.77,5.72 USB1.B5
$1N759: length 6.7
  Top Layer w0.152: v1(29.88,9.26) v1(29.88,12.72)
  Bottom Layer w0.152: USB1.A5 29.34,8.72 v1(29.88,9.26) ; v1(29.88,12.72) 30.12,12.97 30.22,12.97 R10.2
$1N3146: length 53.7
  Bottom Layer w0.152: 33.73,12.64 32.93,13.44 31.94,13.44 31.94,14.73 ; 33.73,12.64 34.53,13.44 34.53,17.55 33.84,18.23 33.84,19.01 ; 33.73,12.64 34.21,12.16 34.21,3.18 33.29,2.26 9.38,2.26 5.92,5.72 5.92,8.66 5.92,8.66 6.48,8.66
$1N3159: length 8.4
  Bottom Layer w0.152: 33.59,26.67 33.59,25.68 33.65,25.63 33.65,22.75 32.68,21.78 32.68,20.85 31.94,20.11 31.94,19.01
$1N3440: length 11.2
  Bottom Layer w0.152: X1.3 11.03,6.37 10.51,6.88 9.68,6.88 5.7,10.86 5.7,11.34 4.86,12.18 4.57,12.18 C3.1
$1N3636: length 30.2
  Top Layer w0.152: v1(31.21,16.47) 31.21,8.07 26.9,3.75 18.19,3.75 v1(15.35,6.6)
  Bottom Layer w0.152: R2.1 30.81,16.89 30.81,16.87 v1(31.21,16.47) ; v1(15.35,6.6) 15.58,6.37 X1.10
$1N11708: length 9
  Bottom Layer w0.152: U3.9 28.44,32.89 28.7,33.15 28.7,34.94 28.74,34.98 28.85,34.98 29.5,35.63 29.5,36.05 30.69,37.24 31.94,37.24 32.63,37.93 CN1.1
$1N11713: length 10.2
  Top Layer w0.152: v1(28.02,31.69) 28.02,35.66 v1(28.96,36.6)
  Bottom Layer w0.152: 31.63,38.89 31.63,37.93 30.29,37.93 v1(28.96,36.6) ; U3.10 27.94,31.77 v1(28.02,31.69)
$1N21943: length 5.9
  Bottom Layer w0.152: 9.53,37.33 8.32,37.33 7.22,36.24 7.22,33.85 7.22,33.84 7.96,33.84
$1N31976: length 3.8
  Bottom Layer w0.152: U8.2 2.03,37.6 2.05,37.62 2.54,37.62 3.41,38.5 3.41,38.95 4.44,38.95
$1N31982: length 3.8
  Bottom Layer w0.152: L2.1 3.41,37.24 3.41,37.11 2.85,36.54 1.54,36.54 1.53,36.55 U8.3
$1N32158: length 8.4
  Bottom Layer w0.152: 9.53,38.98 7.41,38.98 7.41,39.28 7.05,39.63 3.51,39.63 3.32,39.44 3.32,39.26 2.94,38.88 2.53,38.88 U8.8

## Copper pours and planes (outline as drawn; the poured copper is in the pictures)
GND on Top Layer: -7.11,44.95 40.89,44.95 40.89,-4.58 -7.11,-4.58
GND on Bottom Layer: -3.3,42.79 45.85,42.79 45.85,-8.9 -3.3,-8.9

## Text on the board
Bottom Silkscreen Layer: SPK | BAT | - +
Top Silkscreen Layer: Corebb | www.bbrealm.com | 酷睿比比 | Rev 1.10 | bbTalkie
